# EAGLE design MixerModular_module (EAGLE 9.6.2)
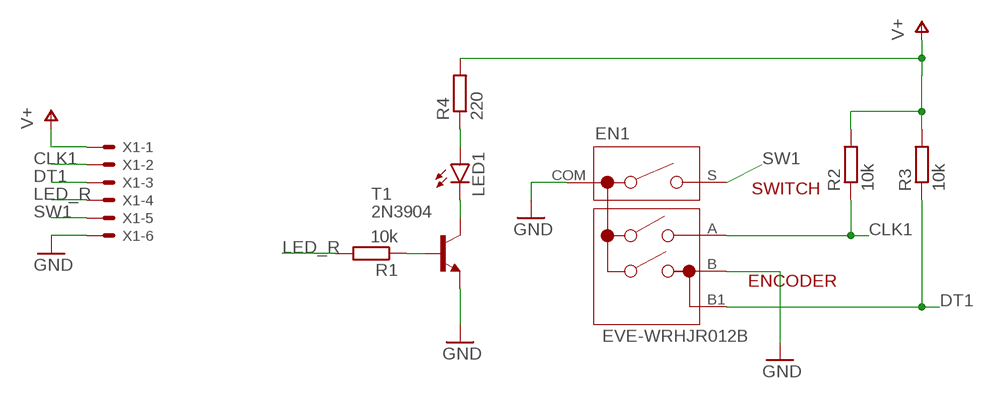
[diagram p0: schematic, sheet 1]

## Parts
EN1  EVE-WRHJR012B  [EVE-WRHJR012B]
LED1  LED5MM  [LED5MM]
R1  10k  R-EU_0207/10  [0207/10]
R2  10k  R-EU_0207/10  [0207/10]
R3  10k  R-EU_0207/10  [0207/10]
R4  220  R-EU_0207/10  [0207/10]
T1  2N3904  [TO92]
X1  22-23-2061  [22-23-2061]

## Nets
CLK1: EN1.A R2.1 X1.2
DT1: EN1.B1 R3.1 X1.3
GND: EN1.B EN1.COM T1.3(E) X1.6
LED_R: R1.2 X1.4
N$1: LED1.A R4.1
N$2: R1.1 T1.2(B)
N$3: LED1.K(C) T1.1(C)
SW1: EN1.S X1.5
V+: R2.2 R3.2 R4.2 X1.1

## Library data of the parts
EN1 = Encoders:EVE-WRHJR012B: ROTARY ENCODER MECHANICAL 12PPR Manufacturer's datasheet <https://media.digikey.com/pdf/Data%20Sheets/Panasonic%20Switches%20PDFs/EVEWRHJR012B.pdf>; CREATED_BY: PCBLayout.com; DIGIKEY_PARTNO: P15917-ND; MANUFACTURER: Panasonic Electronic Components; MPN: EVE-WRHJR012B
LED1 = led:LED: LED OSRAM: - CHIPLED LG R971, LG N971, LY N971, LG Q971, LY Q971, LO R971, LY R971 LH N974, LH R974 LS Q976, LO Q976, LY Q976 LO Q996 - Hyper CHIPLED LW Q18S LB Q993, LB Q99A, LB R99A - SideLED LS A670, LO A670, LY A670, LG A670, LP A670 LB A673, LV A673, LT A673, LW A673 LH A674 LY A675 LS A676, LA A676, LO A676, LY A676, LW A676 LS A679, LY A679, LG A679 - Hyper Micro SIDELED® LS Y876, LA Y876, LO Y876, LY Y876 LT Y87S - SmartLED LW L88C, LW L88S LB L89C, LB L89S, LG L890 LS L89K, LO L89K, LY L89K LS L896, LA L896, LO L896, LY L896 - TOPLED LS T670, LO T670, LY T670, LG T670, LP T670 LSG T670, LSP T670, LSY T670, LOP T670, LYG T670 LG T671, LOG T671, LSG T671 LB T673, LV T673, LT T673, LW T673 LH T674 LS T676, LA T676, LO T676, LY T676, LB T676, LH T676, LSB T676, LW T676 LB T67C, LV T67C, LT T67C, LS T67K, LO T67K, LY T67K, LW E67C LS E67B, LA E67B, LO E67B, LY E67B, LB E67C, LV E67C, LT E67C LW T67C LS T679, LY T679, LG T679 LS T770, LO T770, LY T770, LG T770, LP T770 LB T773, LV T773, LT T773, LW T773 LH T774 LS E675, LA E675, LY E675, LS T675 LS T776, LA T776, LO T776, LY T776, LB T776 LHGB T686 LT T68C, LB T68C - Hyper Mini TOPLED® LB M676 - Mini TOPLED Santana® LG M470 LS M47K, LO M47K, LY M47K Source: http://www.osram.convergy.de LUXEON: - LUMILED® LXK2-PW12-R00, LXK2-PW12-S00, LXK2-PW14-U00, LXK2-PW14-V00 LXK2-PM12-R00, LXK2-PM12-S00, LXK2-PM14-U00 LXK2-PE12-Q00, LXK2-PE12-R00, LXK2-PE12-S00, LXK2-PE14-T00, LXK2-PE14-U00 LXK2-PB12-K00, LXK2-PB12-L00, LXK2-PB12-M00, LXK2-PB14-N00, LXK2-PB14-P00, LXK2-PB14-Q00 LXK2-PR12-L00, LXK2-PR12-M00, LXK2-PR14-Q00, LXK2-PR14-R00 LXK2-PD12-Q00, LXK2-PD12-R00, LXK2-PD12-S00 LXK2-PH12-R00, LXK2-PH12-S00 LXK2-PL12-P00, LXK2-PL12-Q00, LXK2-PL12-R00 Source: www.luxeon.com KINGBRIGHT: KA-3528ASYC Source: www.kingbright.com
R1-R4 = rcl:R-EU_: RESISTOR, European symbol; SPICEPREFIX: R
T1 = transistor:2N3904: NPN TRANSISTOR
X1 = con-molex:22-23-2061: .100" (2.54mm) Center Header - 6 Pin; MF: MOLEX; MPN: 22-23-2061; OC_FARNELL: 1462922; OC_NEWARK: 27C1933

## Board
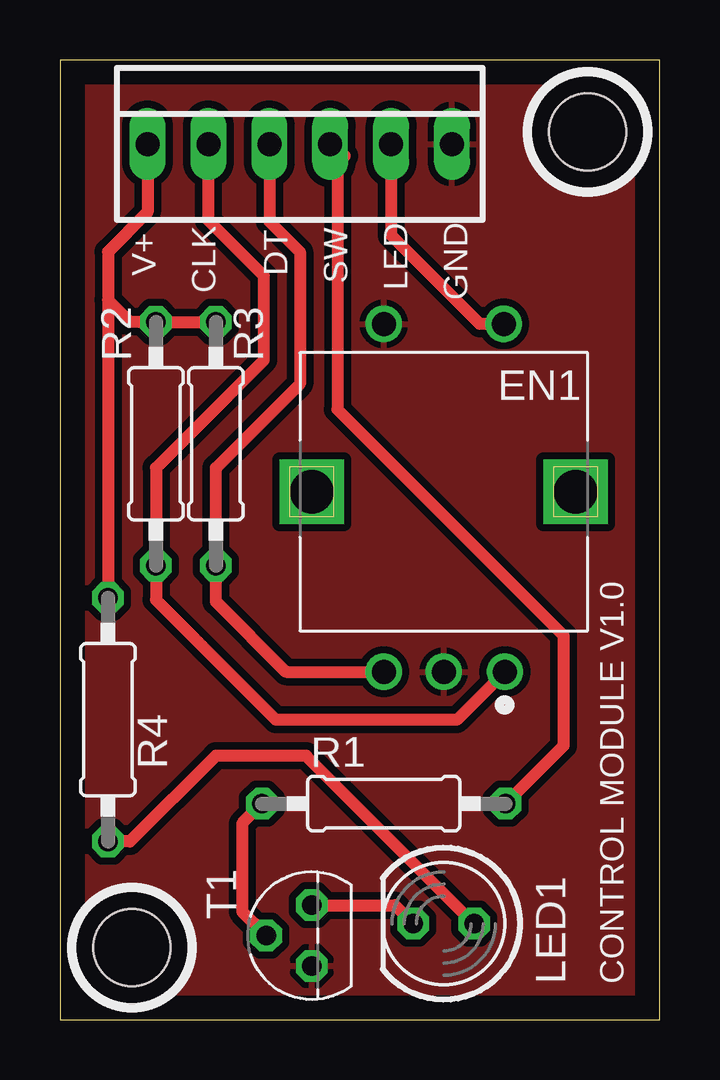
[diagram p1: board, top side]

Size 25 x 40 mm. Coordinates in mm from the lower left corner, seen from the top.
Outline: 0,0 25,0 25,40 0,40 0,0
Copper layers (1*16): Top 0.035mm / dielectric 1.5mm / Bottom 0.035mm
Design rules "default *": minimum track width 6mil, minimum drill 0.35mm, track to track 12mil, track to pad 6mil, pad to pad 6mil, via to via 6mil, smd to smd 6mil, copper to edge 40mil, drill to drill 6mil, minimum pad ring 10mil, minimum via ring 8mil, stop-mask expansion 4mil, vias tented up to drill 0mil, thermal gap 10mil
Holes 3.2 mm at 3,3 22,37

### Footprints (pad centres in the part's own frame; a part is rotated, then mirrored left to right if it is on the bottom)
EVE-WRHJR012B = drill 1: A 2.55,-7.5; B 0,-7.5; B1 -2.5,-7.5; COM -2.5,7; S 2.5,7 | drill 1.8 square: M1 -5.5,0; M2 5.5,0
LED5MM = drill 0.813 octagon: A -1.27,0; K 1.27,0
0207/10 = drill 0.813 octagon: 1 -5.08,0; 2 5.08,0
TO92 = drill 0.813 octagon: 1 1.27,0; 2 0,1.905; 3 -1.27,0
22-23-2061 = drill 1 long: 1 -6.35,0; 2 -3.81,0; 3 -1.27,0; 4 1.27,0; 5 3.81,0; 6 6.35,0

### Placement (x,y rotation side)
EN1  16,22 0 top
LED1  16,4 180 top
R1  13.5,9 0 top
R2  4,24 90 top
R3  6.5,24 90 top
R4  2,12.5 90 top
T1  10.5,3.5 90 top
X1  10,36.5 0 top

### Tracks (layer width: path | path; a pad name or v marks a point on that pad's centre or on a via)
CLK1
  Top 0.508: X1.2 6.19,33.31 8.5,31 8.5,27.5 4,23 R2.1 4,17.5 9,12.5 16.55,12.5 EN1.A
DT1
  Top 0.508: X1.3 8.73,33.27 10,32 10,26.5 6.5,23 R3.1 6.5,17.42 9.42,14.5 EN1.B1
GND
  pour Top: 1,39 24,39 24,1 1,1
LED_R
  Top 0.508: X1.4 11.27,36.3 11.57,36 11.87,36 11.57,35.7 11.57,25.43 21,16 21,11.42 R1.2
N$1
  Top 0.508: LED1.A 10.27,11 6.5,11 2.92,7.42 R4.1
N$2
  Top 0.508: 8.55,3.55 7.59,4.5 7.59,8.18 R1.1
  Top 1.068: T1.2 8.55,3.55
N$3
  Top 0.508: T1.1 13.96,4.77 LED1.K
SW1
  Top 0.508: X1.5 13.81,32.69 17.5,29 EN1.S
V+
  Top 0.508: X1.1 3.65,33.65 2,32 2,30 | 2,30 R4.2 | R2.2 3.92,29.08 | R2.2 R3.2 | R2.2 2.92,29.08 2,30

### Text on the board
tNames: V+ | DT | SW | CLK | LED | GND | CONTROL MODULE V1.0